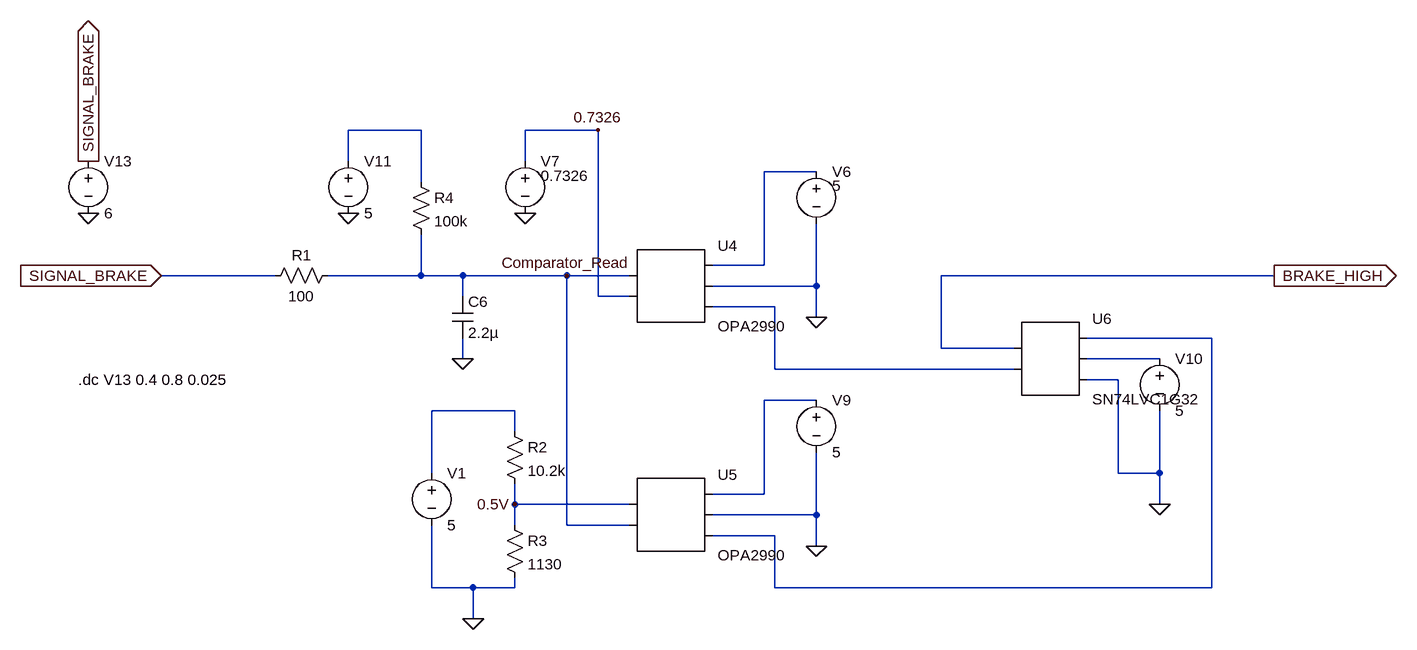
[diagram p0: schematic BSPD_BRAKE.asc]
BSPD_BRAKE.asc, the LTspice schematic file:
Version 4
SHEET 1 1588 1636
WIRE 48 864 -64 864
WIRE 320 864 208 864
WIRE -64 912 -64 864
WIRE 208 912 208 864
WIRE 656 928 576 928
WIRE 48 944 48 864
WIRE 576 1072 576 928
WIRE 576 1072 496 1072
WIRE -176 1088 -352 1088
WIRE 48 1088 48 1024
WIRE 48 1088 -96 1088
WIRE 112 1088 48 1088
WIRE 272 1088 112 1088
WIRE 368 1088 272 1088
WIRE 1360 1088 848 1088
WIRE 656 1104 656 1008
WIRE 656 1104 496 1104
WIRE 112 1120 112 1088
WIRE 320 1120 320 864
WIRE 368 1120 320 1120
WIRE 592 1136 496 1136
WIRE 656 1152 656 1104
WIRE 1264 1184 1072 1184
WIRE 848 1200 848 1088
WIRE 960 1200 848 1200
WIRE 112 1216 112 1184
WIRE 1184 1216 1072 1216
WIRE 592 1232 592 1136
WIRE 960 1232 592 1232
WIRE 1120 1248 1072 1248
WIRE 656 1280 576 1280
WIRE 192 1296 64 1296
WIRE 192 1328 192 1296
WIRE 64 1392 64 1296
WIRE 1120 1392 1120 1248
WIRE 1184 1392 1184 1296
WIRE 1184 1392 1120 1392
WIRE 576 1424 576 1280
WIRE 576 1424 496 1424
WIRE 192 1440 192 1408
WIRE 368 1440 192 1440
WIRE 1184 1440 1184 1392
WIRE 656 1456 656 1360
WIRE 656 1456 496 1456
WIRE 192 1472 192 1440
WIRE 272 1472 272 1088
WIRE 368 1472 272 1472
WIRE 592 1488 496 1488
WIRE 656 1504 656 1456
WIRE 64 1568 64 1472
WIRE 128 1568 64 1568
WIRE 192 1568 192 1552
WIRE 192 1568 128 1568
WIRE 592 1568 592 1488
WIRE 1264 1568 1264 1184
WIRE 1264 1568 592 1568
WIRE 128 1616 128 1568
FLAG 656 1152 0
FLAG 112 1216 0
FLAG 656 1504 0
FLAG 1184 1440 0
FLAG 208 992 0
FLAG -64 992 0
FLAG -352 1088 SIGNAL_BRAKE
IOPIN -352 1088 In
FLAG 1360 1088 BRAKE_HIGH
IOPIN 1360 1088 Out
FLAG -464 992 0
FLAG -464 912 SIGNAL_BRAKE
IOPIN -464 912 Out
FLAG 128 1616 0
FLAG 192 1440 0.5V
FLAG 272 1088 Comparator_Read
FLAG 320 864 0.7326
SYMBOL AutoGenerated/OPA2990 432 1104 R0
SYMATTR InstName U4
SYMBOL voltage 656 912 R0
WINDOW 3 24 38 Left 2
SYMATTR Value 5
SYMATTR InstName V6
SYMBOL voltage 208 896 R0
WINDOW 3 24 38 Left 2
SYMATTR Value 0.7326
SYMATTR InstName V7
SYMBOL res -80 1072 R90
WINDOW 0 0 56 VBottom 2
WINDOW 3 32 56 VTop 2
SYMATTR InstName R1
SYMATTR Value 100
SYMBOL cap 96 1120 R0
SYMATTR InstName C6
SYMATTR Value 2.2µ
SYMBOL AutoGenerated/OPA2990 432 1456 R0
SYMATTR InstName U5
SYMBOL voltage 656 1264 R0
SYMATTR InstName V9
SYMATTR Value 5
SYMBOL AutoGenerated/SN74LVC1G32 1008 1216 R0
SYMATTR InstName U6
SYMBOL voltage 1184 1200 R0
SYMATTR InstName V10
SYMATTR Value 5
SYMBOL voltage -64 896 R0
SYMATTR InstName V11
SYMATTR Value 5
SYMBOL voltage -464 896 R0
SYMATTR InstName V13
SYMATTR Value 6
SYMBOL res 32 928 R0
SYMATTR InstName R4
SYMATTR Value 100k
SYMBOL voltage 64 1376 R0
SYMATTR InstName V1
SYMATTR Value 5
SYMBOL res 176 1312 R0
SYMATTR InstName R2
SYMATTR Value 10.2k
SYMBOL res 176 1456 R0
SYMATTR InstName R3
SYMATTR Value 1130
TEXT -480 1248 Left 2 !.dc V13 0.4 0.8 0.025

The netlist it stands for:
* BSPD_BRAKE.asc
* U4: OPA2990 (symbol AutoGenerated/OPA2990 not available, pins judged from their places): pin1=Comparator_Read pin2=0.7326 pin3=N002 pin4=0 pin5=N003
V6 N002 0 5
V7 0.7326 0 0.7326
R1 Comparator_Read SIGNAL_BRAKE 100
C6 Comparator_Read 0 2.2µ
* U5: OPA2990 (symbol AutoGenerated/OPA2990 not available, pins judged from their places): pin1=0.5V pin2=Comparator_Read pin3=N006 pin4=0 pin5=N004
V9 N006 0 5
* U6: SN74LVC1G32 (symbol AutoGenerated/SN74LVC1G32 not available, pins judged from their places): pin1=BRAKE_HIGH pin2=N003 pin3=N004 pin4=N005 pin5=0
V10 N005 0 5
V11 N001 0 5
V13 SIGNAL_BRAKE 0 6
R4 N001 Comparator_Read 100k
V1 N007 0 5
R2 N007 0.5V 10.2k
R3 0.5V 0 1130
.dc V13 0.4 0.8 0.025
.backanno
.end